# EAGLE schematic 2uprava6 (EAGLE 9.5.2)
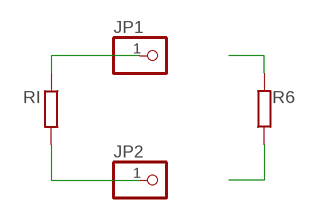
[diagram p0: schematic, sheet 1]

## Parts
JP1  PINHD-1X1  [1X01]
JP2  PINHD-1X1  [1X01]
R6  200R  R-EU_0204/7  [0204/7]
RI  570R  R-EU_0204/7  [0204/7]

## Nets
N$1: JP1.1 RI.1
N$2: JP2.1 RI.2
N$6: R6.2
N$7: R6.1

## Library data of the parts
JP1 JP2 = pinhead:PINHD-1X1: PIN HEADER
R6 RI = rcl:R-EU_: RESISTOR, European symbol; SPICEPREFIX: R